# EAGLE design vacbox (EAGLE 7.7.0)
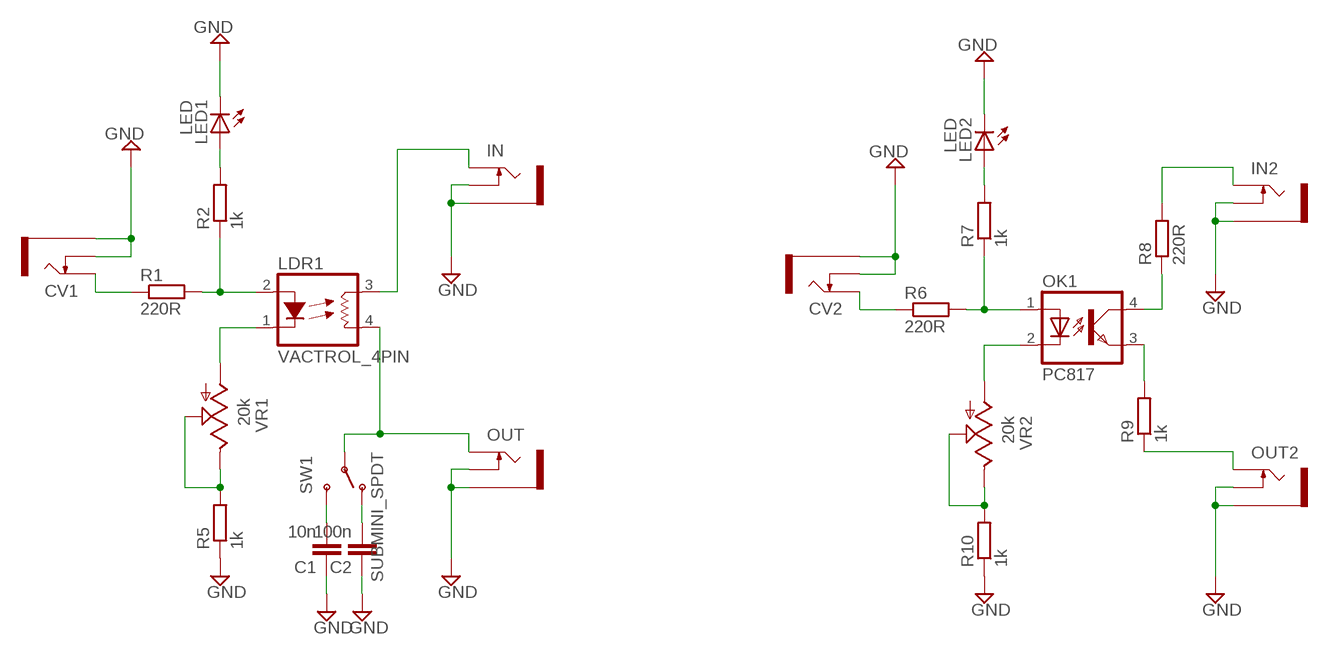
[diagram p0: schematic, sheet 1]

## Parts
C1  10n  C-EU050-025X075  [C050-025X075]
C2  100n  C-EU050-025X075  [C050-025X075]
CV1  PJ302M  [PJ302M]
CV2  PJ302M  [PJ302M]
IN  PJ302M  [PJ302M]
IN2  PJ302M  [PJ302M]
LDR1  VACTROL_4PIN  [VACTROL_4PIN_VTL5C]
LED1  LED  LED3MM  [LED3MM]
LED2  LED  LED3MM  [LED3MM]
OK1  PC817  [DIL04]
OUT  PJ302M  [PJ302M]
OUT2  PJ302M  [PJ302M]
R1  220R  R-EU_0207/2V  [0207/2V]
R2  1k  R-EU_0207/2V  [0207/2V]
R5  1k  R-EU_0207/2V  [0207/2V]
R6  220R  R-EU_0207/2V  [0207/2V]
R7  1k  R-EU_0207/2V  [0207/2V]
R8  220R  R-EU_0207/2V  [0207/2V]
R9  1k  R-EU_0207/2V  [0207/2V]
R10  1k  R-EU_0207/2V  [0207/2V]
SW1  SUBMINI_SPDT  [SUBMINI_TOGGLE]
VR1  20k  9MM_SNAP-IN_POT_  [9MM_SNAP-IN_POT]
VR2  20k  9MM_SNAP-IN_POT_  [9MM_SNAP-IN_POT]

## Nets
CV2: CV2.TIP R6.1
CV_IN: LDR1.2(LED+) R1.2 R2.1
CV_IN1: OK1.1(A) R6.2 R7.1
CV_OUT: LDR1.1(LED-) VR1.1(A)
CV_OUT1: OK1.2(C) VR2.1(A)
GND: C1.1 C2.1 CV1.GND(SLEEVE) CV1.SW(SWITCH) CV2.GND(SLEEVE) CV2.SW(SWITCH) IN2.GND(SLEEVE) IN2.SW(SWITCH) IN.GND(SLEEVE) IN.SW(SWITCH) LED1.K(C) LED2.K(C) OUT2.GND(SLEEVE) OUT2.SW(SWITCH) OUT.GND(SLEEVE) OUT.SW(SWITCH) R5.1 R10.1
N$1: R5.2 VR1.2(S) VR1.3(E)
N$2: OUT2.TIP R9.1
N$3: OK1.4(COL) R8.1
N$5: LED2.A R7.2
N$6: C1.2 SW1.3(S)
N$7: R10.2 VR2.2(S) VR2.3(E)
N$8: C2.2 SW1.1(O)
N$10: CV1.TIP R1.1
N$12: LED1.A R2.2
SIG_IN: IN.TIP LDR1.3(RES1)
SIG_IN1: IN2.TIP R8.2
SIG_OUT: LDR1.4(RES2) OUT.TIP SW1.COM(COMMON)
SIG_OUT1: OK1.3(EMIT) R9.2

## Library data of the parts
C1 C2 = rcl:C-EU: CAPACITOR, European symbol
CV1 CV2 IN IN2 OUT OUT2 = pj302m:PJ302M: PJ302M horizontal / right angled mount 3.5 mm jack socket
LDR1 = MusicThingModular:VACTROL_4PIN: 4 Pin Vactrol Resistive Photocoupler
LED1 LED2 = led:LED: LED OSRAM: - CHIPLED LG R971, LG N971, LY N971, LG Q971, LY Q971, LO R971, LY R971 LH N974, LH R974 LS Q976, LO Q976, LY Q976 LO Q996 - Hyper CHIPLED LW Q18S LB Q993, LB Q99A, LB R99A - SideLED LS A670, LO A670, LY A670, LG A670, LP A670 LB A673, LV A673, LT A673, LW A673 LH A674 LY A675 LS A676, LA A676, LO A676, LY A676, LW A676 LS A679, LY A679, LG A679 - Hyper Micro SIDELED® LS Y876, LA Y876, LO Y876, LY Y876 LT Y87S - SmartLED LW L88C, LW L88S LB L89C, LB L89S, LG L890 LS L89K, LO L89K, LY L89K LS L896, LA L896, LO L896, LY L896 - TOPLED LS T670, LO T670, LY T670, LG T670, LP T670 LSG T670, LSP T670, LSY T670, LOP T670, LYG T670 LG T671, LOG T671, LSG T671 LB T673, LV T673, LT T673, LW T673 LH T674 LS T676, LA T676, LO T676, LY T676, LB T676, LH T676, LSB T676, LW T676 LB T67C, LV T67C, LT T67C, LS T67K, LO T67K, LY T67K, LW E67C LS E67B, LA E67B, LO E67B, LY E67B, LB E67C, LV E67C, LT E67C LW T67C LS T679, LY T679, LG T679 LS T770, LO T770, LY T770, LG T770, LP T770 LB T773, LV T773, LT T773, LW T773 LH T774 LS E675, LA E675, LY E675, LS T675 LS T776, LA T776, LO T776, LY T776, LB T776 LHGB T686 LT T68C, LB T68C - Hyper Mini TOPLED® LB M676 - Mini TOPLED Santana® LG M470 LS M47K, LO M47K, LY M47K Source: http://www.osram.convergy.de LUXEON: - LUMILED® LXK2-PW12-R00, LXK2-PW12-S00, LXK2-PW14-U00, LXK2-PW14-V00 LXK2-PM12-R00, LXK2-PM12-S00, LXK2-PM14-U00 LXK2-PE12-Q00, LXK2-PE12-R00, LXK2-PE12-S00, LXK2-PE14-T00, LXK2-PE14-U00 LXK2-PB12-K00, LXK2-PB12-L00, LXK2-PB12-M00, LXK2-PB14-N00, LXK2-PB14-P00, LXK2-PB14-Q00 LXK2-PR12-L00, LXK2-PR12-M00, LXK2-PR14-Q00, LXK2-PR14-R00 LXK2-PD12-Q00, LXK2-PD12-R00, LXK2-PD12-S00 LXK2-PH12-R00, LXK2-PH12-S00 LXK2-PL12-P00, LXK2-PL12-Q00, LXK2-PL12-R00 Source: www.luxeon.com KINGBRIGHT: KA-3528ASYC Source: www.kingbright.com
OK1 = optocoupler:PC817: SHARP OPTO COUPLER; MPN: PC817X4J000F; OC_FARNELL: 9707727; OC_NEWARK: 97K7059
R1 R2 R5-R10 = rcl:R-EU_: RESISTOR, European symbol
SW1 = MusicThingModular:SUBMINI_SPDT
VR1 VR2 = MusicThingModular:9MM_SNAP-IN_POT: 9mm vertical snap-in pot, Alpha / Panasonic style

## Board
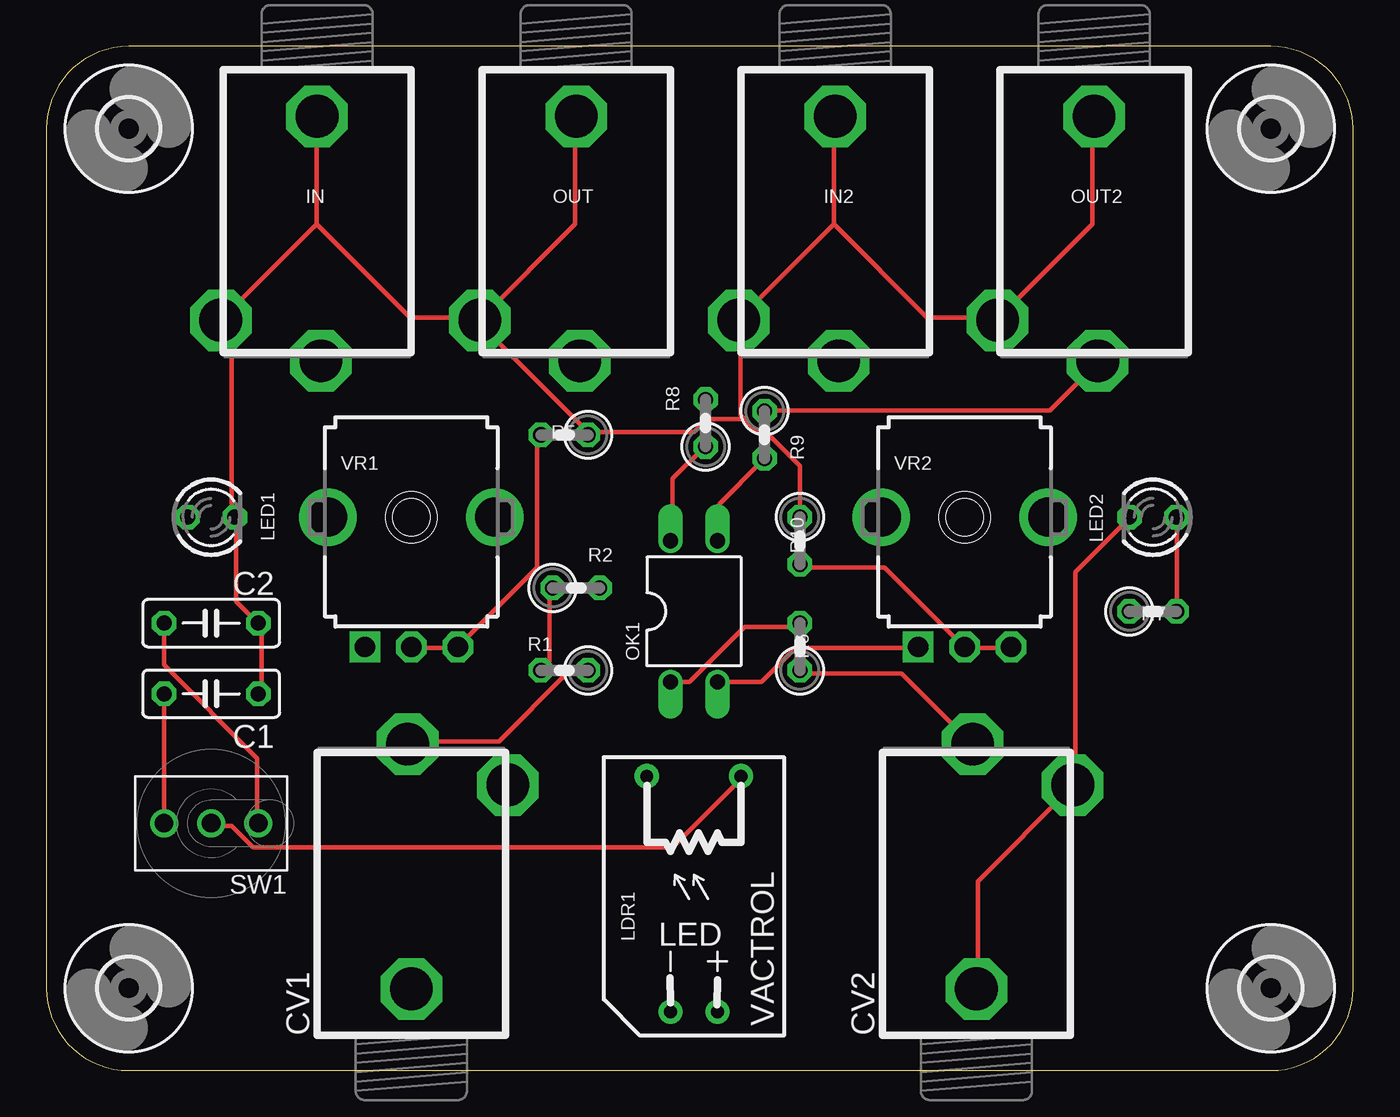
[diagram p1: board, top side]
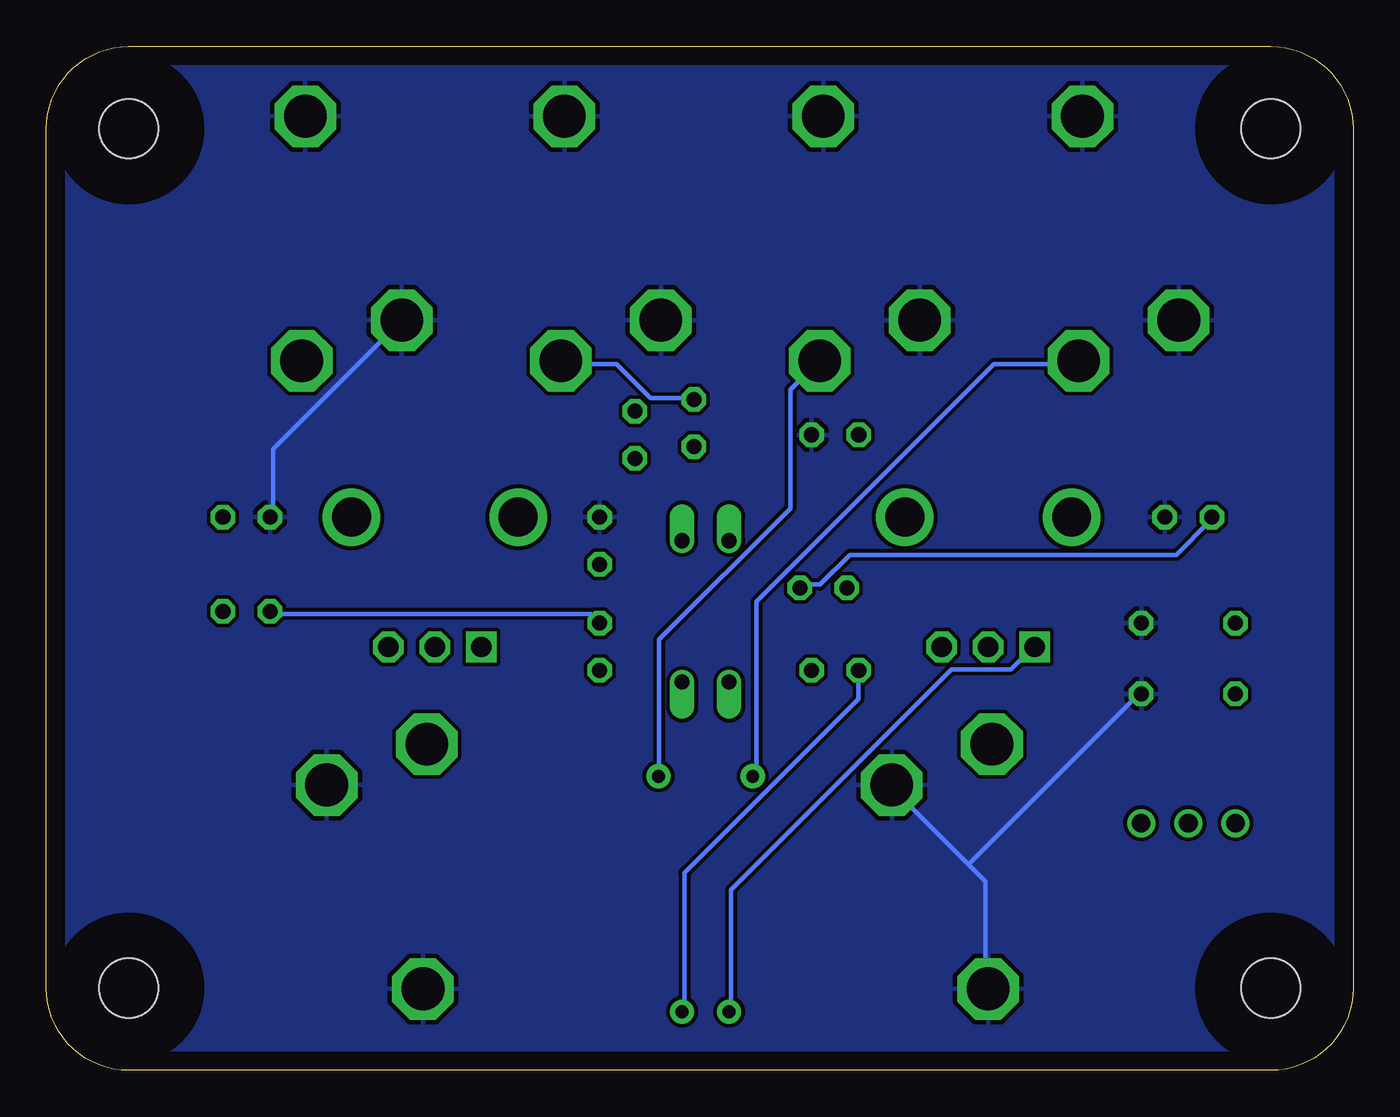
[diagram p2: board, bottom side, seen from below]

Size 70.48 x 55.25 mm. Coordinates in mm from the lower left corner, seen from the top.
Outline: 0,50.8 0,4.45 arc90 4.45,0 66.04,0 arc90 70.48,4.45 70.48,50.8 arc90 66.04,55.25 4.45,55.25 arc90 0,50.8
Copper layers (1*16): Top 0.035mm / dielectric 1.5mm / Bottom 0.035mm
Design rules "default": minimum track width 10mil, minimum drill 24mil, track to track 8mil, track to pad 8mil, pad to pad 8mil, via to via 8mil, smd to smd 8mil, copper to edge 40mil, drill to drill 8mil, minimum pad ring 10mil, minimum via ring 8mil, stop-mask expansion 4mil, vias tented up to drill 0mil, thermal gap 10mil

### Footprints (pad centres in the part's own frame; a part is rotated, then mirrored left to right if it is on the bottom)
C050-025X075 = drill 0.813 octagon: 1 -2.54,0; 2 2.54,0
PJ302M = drill 2.3 pad 3.3 octagon: GND 2.5,0; SW 13.5,-5.2; TIP 15.7,0.2
VACTROL_4PIN_VTL5C = drill 0.7 pad 1.3: 1 -6.35,1.27; 2 -6.35,-1.27; 3 6.35,2.54; 4 6.35,-2.54
LED3MM = drill 0.813 octagon: A -1.27,0; K 1.27,0
DIL04 = drill 0.813 offset: 1 -1.27,-3.81; 2 1.27,-3.81; 3 1.27,3.81; 4 -1.27,3.81
0207/2V = drill 0.813 octagon: 1 -1.27,0; 2 1.27,0
SUBMINI_TOGGLE = drill 1 pad 1.422: 1 -2.54,0; 3 2.54,0; COM 0,0
3,2 = hole 3.2: 0,0
9MM_SNAP-IN_POT = drill 1.1 square: 1 -2.5,-7 | drill 1.1 octagon: 2 0,-7; 3 2.5,-7 | drill 2.1 pad 2.794: CHASSIS1 -4.5,0; CHASSIS2 4.5,0

### Placement (x,y rotation side)
C1  8.89,20.32 180 top
C2  8.89,24.13 180 top
CV1  19.69,1.91 90 top
CV2  50.16,1.91 90 top
IN  14.6,53.97 270 top
IN2  42.55,53.97 270 top
LDR1  34.92,9.52 90 top
LED1  8.89,29.84 0 top
LED2  59.69,29.84 180 top
OK1  34.92,24.77 0 top
OUT  28.57,53.97 270 top
OUT2  56.52,53.97 270 top
R1  27.94,21.59 180 top
R2  28.57,26.03 0 top
R5  27.94,34.29 180 top
R6  40.64,22.86 90 top
R7  59.69,24.77 0 top
R8  35.56,34.92 90 top
R9  38.73,34.29 270 top
R10  40.64,28.58 270 top
SW1  8.89,13.34 180 top
U$1  [3,2]  4.45,50.8 0 top
U$2  [3,2]  66.04,50.8 0 top
U$3  [3,2]  4.45,4.45 0 top
U$4  [3,2]  66.04,4.45 0 top
VR1  19.69,29.84 0 top
VR2  49.53,29.84 0 top

### Tracks (layer width: path | path; a pad name or v marks a point on that pad's centre or on a via)
CV2
  Top 0.254: R6.1 40.64,21.41 46.13,21.41 49.78,17.76 CV2.TIP
CV_IN
  Top 0.254: R2.1 27.15,25.98 27.15,22.1 26.7,21.64 R1.2
  Bottom 0.254: LDR1.2 36.07,3.35 36.07,10.67 26.7,20.04 26.7,21.41 R1.2
CV_IN1
  Top 0.254: OK1.1 34.7,20.95 37.67,23.93 40.64,23.93 R6.2
  Bottom 0.254: R7.1 58.24,24.61 41.1,24.61 40.64,24.16 R6.2
CV_OUT
  Bottom 0.254: LDR1.1 33.55,3.35 33.55,9.75 21.67,21.64 18.47,21.64 17.32,22.78 VR1.1
CV_OUT1
  Top 0.254: OK1.2 38.58,20.95 40.41,22.78 46.81,22.78 VR2.1
GND
  Top 0.254: CV2.GND 50.24,4.5 50.24,10.21 55.27,15.24 CV2.SW 55.5,15.47 55.5,26.9 58.24,29.64 LED2.K | OUT2.GND 56.41,51.36 56.41,45.64 51.38,40.61 OUT2.SW 51.16,40.61 47.5,40.61 42.47,45.64 | 29.21,34.44 23.27,40.39 OUT.SW | OUT.GND 28.52,51.36 28.52,45.64 23.49,40.61 OUT.SW | R10.1 40.64,32.61 38.81,34.44 38.35,34.44 37.67,35.13 | 37.67,35.13 37.44,35.36 37.44,40.39 IN2.SW 37.44,40.61 42.47,45.64 | 42.47,45.64 42.47,51.36 IN2.GND | 29.21,34.44 34.92,34.44 35.61,35.13 37.67,35.13 | 29.21,34.44 R5.1 | C1.1 11.61,20.5 11.61,23.93 C2.1 11.38,24.16 10.24,25.3 10.24,29.64 LED1.K 10.01,29.87 10.01,39.93 9.55,40.39 IN.SW 9.55,40.61 14.58,45.64 | 14.58,45.64 14.58,51.36 IN.GND | 14.58,45.64 19.61,40.61 23.27,40.61 OUT.SW
  Bottom 0.254: LED2.K 58.24,29.87 58.24,33.53 51.38,40.39 OUT2.SW | 20.75,11.12 24.87,15.24 CV1.SW | 20.75,11.12 19.84,10.21 19.84,4.5 CV1.GND | 20.75,11.12 11.61,20.27 C1.1
  pour Bottom: -0.63,55.25 70.48,55.25 70.48,-0.64 -0.63,-0.64
N$1
  Top 0.254: R5.2 26.47,34.21 26.47,27.13 22.35,23.01 VR1.3 22.12,22.78 19.84,22.78 VR1.2
N$2
  Top 0.254: R9.1 38.81,35.59 54.13,35.59 56.64,38.1 OUT2.TIP
N$3
  Top 0.254: OK1.4 33.78,28.73 33.78,31.93 35.38,33.53 R8.1
N$4
  Bottom 0.406: 5.08,4.45 4.45,4.45
N$5
  Top 0.254: R7.2 60.98,24.84 60.98,29.64 LED2.A
N$6
  Top 0.254: SW1.3 C1.2
N$7
  Top 0.254: R10.2 40.64,27.13 45.21,27.13 49.33,23.01 VR2.2 49.55,22.78 51.84,22.78 VR2.3
N$8
  Top 0.254: C2.2 6.35,21.87 11.38,16.84 11.38,13.41 SW1.1
N$10
  Top 0.254: R1.1 29.21,21.41 28.07,21.41 24.41,17.76 19.61,17.76 CV1.TIP
N$12
  Bottom 0.254: R2.2 29.67,26.21 28.75,26.21 27.15,27.81 9.55,27.81 7.72,29.64 LED1.A
SIG_IN
  Bottom 0.254: LDR1.3 32.18,15.93 32.18,25.3 19.38,38.1 14.81,38.1 IN.TIP
SIG_IN1
  Bottom 0.254: R8.2 35.61,36.27 37.9,36.27 39.73,38.1 42.7,38.1 IN2.TIP
SIG_OUT
  Top 0.254: SW1.COM 9.09,13.18 10.01,13.18 11.15,12.04 33.78,12.04 37.44,15.7 LDR1.4
  Bottom 0.254: LDR1.4 37.44,15.93 37.44,23.24 30.35,30.33 30.35,36.73 28.98,38.1 OUT.TIP
SIG_OUT1
  Top 0.254: OK1.3 36.3,28.73 36.3,30.56 38.58,32.84 R9.2